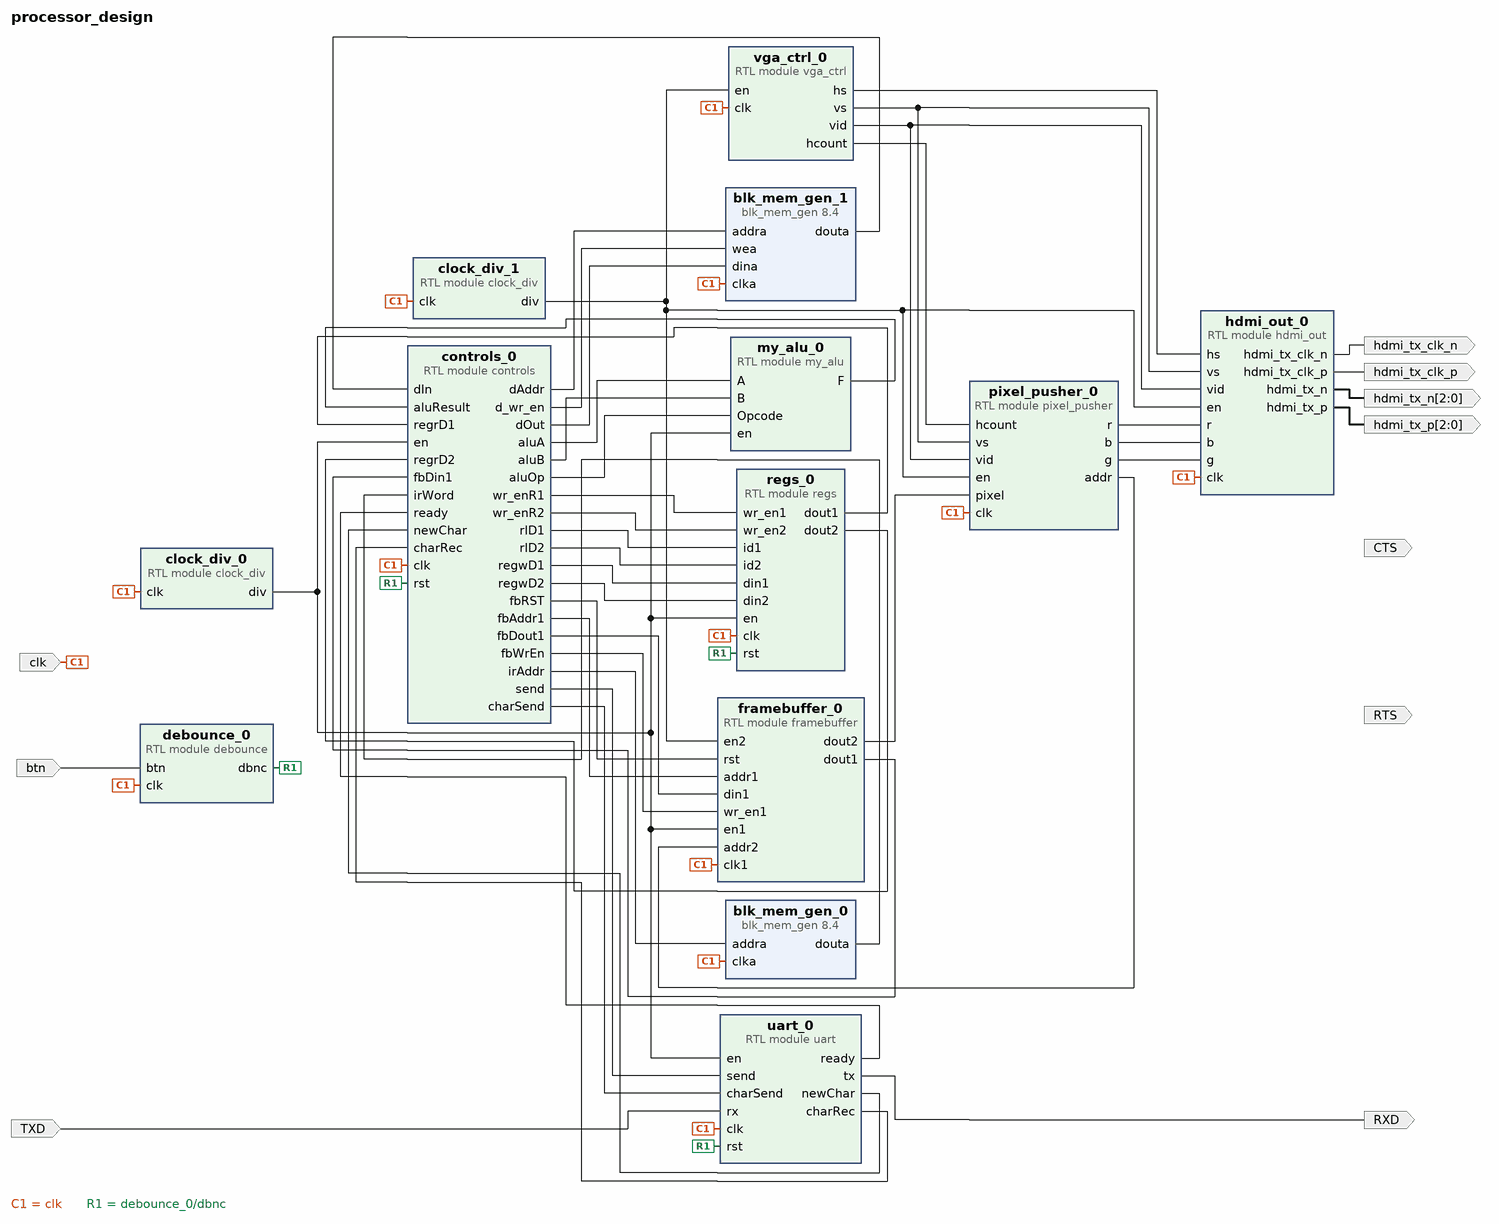
[diagram p0: block diagram of the top level]
# Vivado block design processor_design, xc7z010clg400-1, Vivado 2018.2
create_bd_design processor_design

create_bd_port -dir I clk
create_bd_port -dir I btn
create_bd_port -dir O hdmi_tx_clk_p
create_bd_port -dir O hdmi_tx_clk_n
create_bd_port -dir O -from 2 -to 0 hdmi_tx_n
create_bd_port -dir O -from 2 -to 0 hdmi_tx_p
create_bd_port -dir I TXD
create_bd_port -dir O RXD
create_bd_port -dir O CTS
create_bd_port -dir O RTS

create_bd_cell -type module -reference clock_div clock_div_0
set_property -dict {CONFIG.div_int 1085} [get_bd_cells clock_div_0]
create_bd_cell -type module -reference debounce debounce_0
create_bd_cell -type module -reference regs regs_0
create_bd_cell -type module -reference clock_div clock_div_1
set_property -dict {CONFIG.div_int 5} [get_bd_cells clock_div_1]
create_bd_cell -type module -reference my_alu my_alu_0
create_bd_cell -type module -reference uart uart_0
create_bd_cell -type module -reference vga_ctrl vga_ctrl_0
create_bd_cell -type ip -vlnv xilinx.com:ip:blk_mem_gen:8.4 blk_mem_gen_0
set_property -dict [list \
  CONFIG.Memory_Type Single_Port_ROM \
  CONFIG.Enable_32bit_Address false \
  CONFIG.Write_Depth_A 16384 \
  CONFIG.Enable_A Always_Enabled \
  CONFIG.Register_PortA_Output_of_Memory_Primitives false \
  CONFIG.Load_Init_File true \
  CONFIG.Coe_File {c:/Users/Sabian Corrette/Downloads/lab5/Hello_World_text.coe} \
  CONFIG.Use_RSTA_Pin false \
  CONFIG.Port_A_Write_Rate 0 \
  CONFIG.use_bram_block Stand_Alone \
] [get_bd_cells blk_mem_gen_0]
create_bd_cell -type ip -vlnv xilinx.com:ip:blk_mem_gen:8.4 blk_mem_gen_1
set_property -dict [list \
  CONFIG.Memory_Type Single_Port_RAM \
  CONFIG.Enable_32bit_Address false \
  CONFIG.Use_Byte_Write_Enable false \
  CONFIG.Write_Width_A 16 \
  CONFIG.Write_Depth_A 32768 \
  CONFIG.Read_Width_A 16 \
  CONFIG.Enable_A Always_Enabled \
  CONFIG.Register_PortA_Output_of_Memory_Primitives false \
  CONFIG.Load_Init_File true \
  CONFIG.Coe_File {c:/Users/Sabian Corrette/Downloads/lab5/Hello_World_data.coe} \
  CONFIG.Use_RSTA_Pin false \
  CONFIG.Port_A_Write_Rate 50 \
  CONFIG.use_bram_block Stand_Alone \
] [get_bd_cells blk_mem_gen_1]
create_bd_cell -type module -reference controls controls_0
create_bd_cell -type module -reference hdmi_out hdmi_out_0
create_bd_cell -type module -reference pixel_pusher pixel_pusher_0
create_bd_cell -type module -reference framebuffer framebuffer_0

# ---- connections ----

connect_bd_net [get_bd_ports clk] \
  [get_bd_pins clock_div_0/clk] [get_bd_pins regs_0/clk] [get_bd_pins debounce_0/clk] [get_bd_pins clock_div_1/clk] \
  [get_bd_pins uart_0/clk] [get_bd_pins vga_ctrl_0/clk] [get_bd_pins blk_mem_gen_0/clka] [get_bd_pins blk_mem_gen_1/clka] \
  [get_bd_pins controls_0/clk] [get_bd_pins hdmi_out_0/clk] [get_bd_pins pixel_pusher_0/clk] [get_bd_pins framebuffer_0/clk1]
connect_bd_net [get_bd_pins clock_div_0/div] \
  [get_bd_pins regs_0/en] [get_bd_pins my_alu_0/en] [get_bd_pins uart_0/en] [get_bd_pins controls_0/en] \
  [get_bd_pins framebuffer_0/en1]
connect_bd_net [get_bd_pins debounce_0/dbnc] [get_bd_pins regs_0/rst] [get_bd_pins uart_0/rst] [get_bd_pins controls_0/rst]
connect_bd_net [get_bd_pins clock_div_1/div] \
  [get_bd_pins vga_ctrl_0/en] [get_bd_pins hdmi_out_0/en] [get_bd_pins pixel_pusher_0/en] [get_bd_pins framebuffer_0/en2]
connect_bd_net [get_bd_pins controls_0/fbRST] [get_bd_pins framebuffer_0/rst]
connect_bd_net [get_bd_pins controls_0/wr_enR1] [get_bd_pins regs_0/wr_en1]
connect_bd_net [get_bd_pins controls_0/wr_enR2] [get_bd_pins regs_0/wr_en2]
connect_bd_net [get_bd_pins controls_0/rID1] [get_bd_pins regs_0/id1]
connect_bd_net [get_bd_pins controls_0/rID2] [get_bd_pins regs_0/id2]
connect_bd_net [get_bd_pins regs_0/dout1] [get_bd_pins controls_0/regrD1]
connect_bd_net [get_bd_pins regs_0/dout2] [get_bd_pins controls_0/regrD2]
connect_bd_net [get_bd_pins controls_0/regwD1] [get_bd_pins regs_0/din1]
connect_bd_net [get_bd_pins controls_0/regwD2] [get_bd_pins regs_0/din2]
connect_bd_net [get_bd_pins controls_0/fbAddr1] [get_bd_pins framebuffer_0/addr1]
connect_bd_net [get_bd_pins controls_0/fbDout1] [get_bd_pins framebuffer_0/din1]
connect_bd_net [get_bd_pins controls_0/aluA] [get_bd_pins my_alu_0/A]
connect_bd_net [get_bd_pins controls_0/aluB] [get_bd_pins my_alu_0/B]
connect_bd_net [get_bd_pins controls_0/aluOp] [get_bd_pins my_alu_0/Opcode]
connect_bd_net [get_bd_pins framebuffer_0/dout1] [get_bd_pins controls_0/fbDin1]
connect_bd_net [get_bd_pins my_alu_0/F] [get_bd_pins controls_0/aluResult]
connect_bd_net [get_bd_pins vga_ctrl_0/vs] [get_bd_pins hdmi_out_0/vs] [get_bd_pins pixel_pusher_0/vs]
connect_bd_net [get_bd_pins vga_ctrl_0/vid] [get_bd_pins hdmi_out_0/vid] [get_bd_pins pixel_pusher_0/vid]
connect_bd_net [get_bd_pins vga_ctrl_0/hcount] [get_bd_pins pixel_pusher_0/hcount]
connect_bd_net [get_bd_pins pixel_pusher_0/addr] [get_bd_pins framebuffer_0/addr2]
connect_bd_net [get_bd_pins framebuffer_0/dout2] [get_bd_pins pixel_pusher_0/pixel]
connect_bd_net [get_bd_pins controls_0/send] [get_bd_pins uart_0/send]
connect_bd_net [get_bd_pins controls_0/charSend] [get_bd_pins uart_0/charSend]
connect_bd_net [get_bd_pins uart_0/ready] [get_bd_pins controls_0/ready]
connect_bd_net [get_bd_pins uart_0/newChar] [get_bd_pins controls_0/newChar]
connect_bd_net [get_bd_pins uart_0/charRec] [get_bd_pins controls_0/charRec]
connect_bd_net [get_bd_pins pixel_pusher_0/r] [get_bd_pins hdmi_out_0/r]
connect_bd_net [get_bd_pins pixel_pusher_0/b] [get_bd_pins hdmi_out_0/b]
connect_bd_net [get_bd_pins pixel_pusher_0/g] [get_bd_pins hdmi_out_0/g]
connect_bd_net [get_bd_pins vga_ctrl_0/hs] [get_bd_pins hdmi_out_0/hs]
connect_bd_net [get_bd_pins controls_0/irAddr] [get_bd_pins blk_mem_gen_0/addra]
connect_bd_net [get_bd_pins blk_mem_gen_0/douta] [get_bd_pins controls_0/irWord]
connect_bd_net [get_bd_pins blk_mem_gen_1/douta] [get_bd_pins controls_0/dIn]
connect_bd_net [get_bd_pins controls_0/dAddr] [get_bd_pins blk_mem_gen_1/addra]
connect_bd_net [get_bd_ports btn] [get_bd_pins debounce_0/btn]
connect_bd_net [get_bd_pins hdmi_out_0/hdmi_tx_clk_p] [get_bd_ports hdmi_tx_clk_p]
connect_bd_net [get_bd_pins hdmi_out_0/hdmi_tx_clk_n] [get_bd_ports hdmi_tx_clk_n]
connect_bd_net [get_bd_pins hdmi_out_0/hdmi_tx_n] [get_bd_ports hdmi_tx_n]
connect_bd_net [get_bd_pins hdmi_out_0/hdmi_tx_p] [get_bd_ports hdmi_tx_p]
connect_bd_net [get_bd_ports TXD] [get_bd_pins uart_0/rx]
connect_bd_net [get_bd_pins uart_0/tx] [get_bd_ports RXD]
connect_bd_net [get_bd_pins controls_0/d_wr_en] [get_bd_pins blk_mem_gen_1/wea]
connect_bd_net [get_bd_pins controls_0/dOut] [get_bd_pins blk_mem_gen_1/dina]
connect_bd_net [get_bd_pins controls_0/fbWrEn] [get_bd_pins framebuffer_0/wr_en1]

validate_bd_design
save_bd_design
